# EasyEDA schematic SCH_host-rev-2.0_2025-11-23.json
TITLE: Sheet_1; REV: 2.5; Date: 2025-11-12; Sheet: 1/1; Drawn By: saymonislam924; Company: Your Company
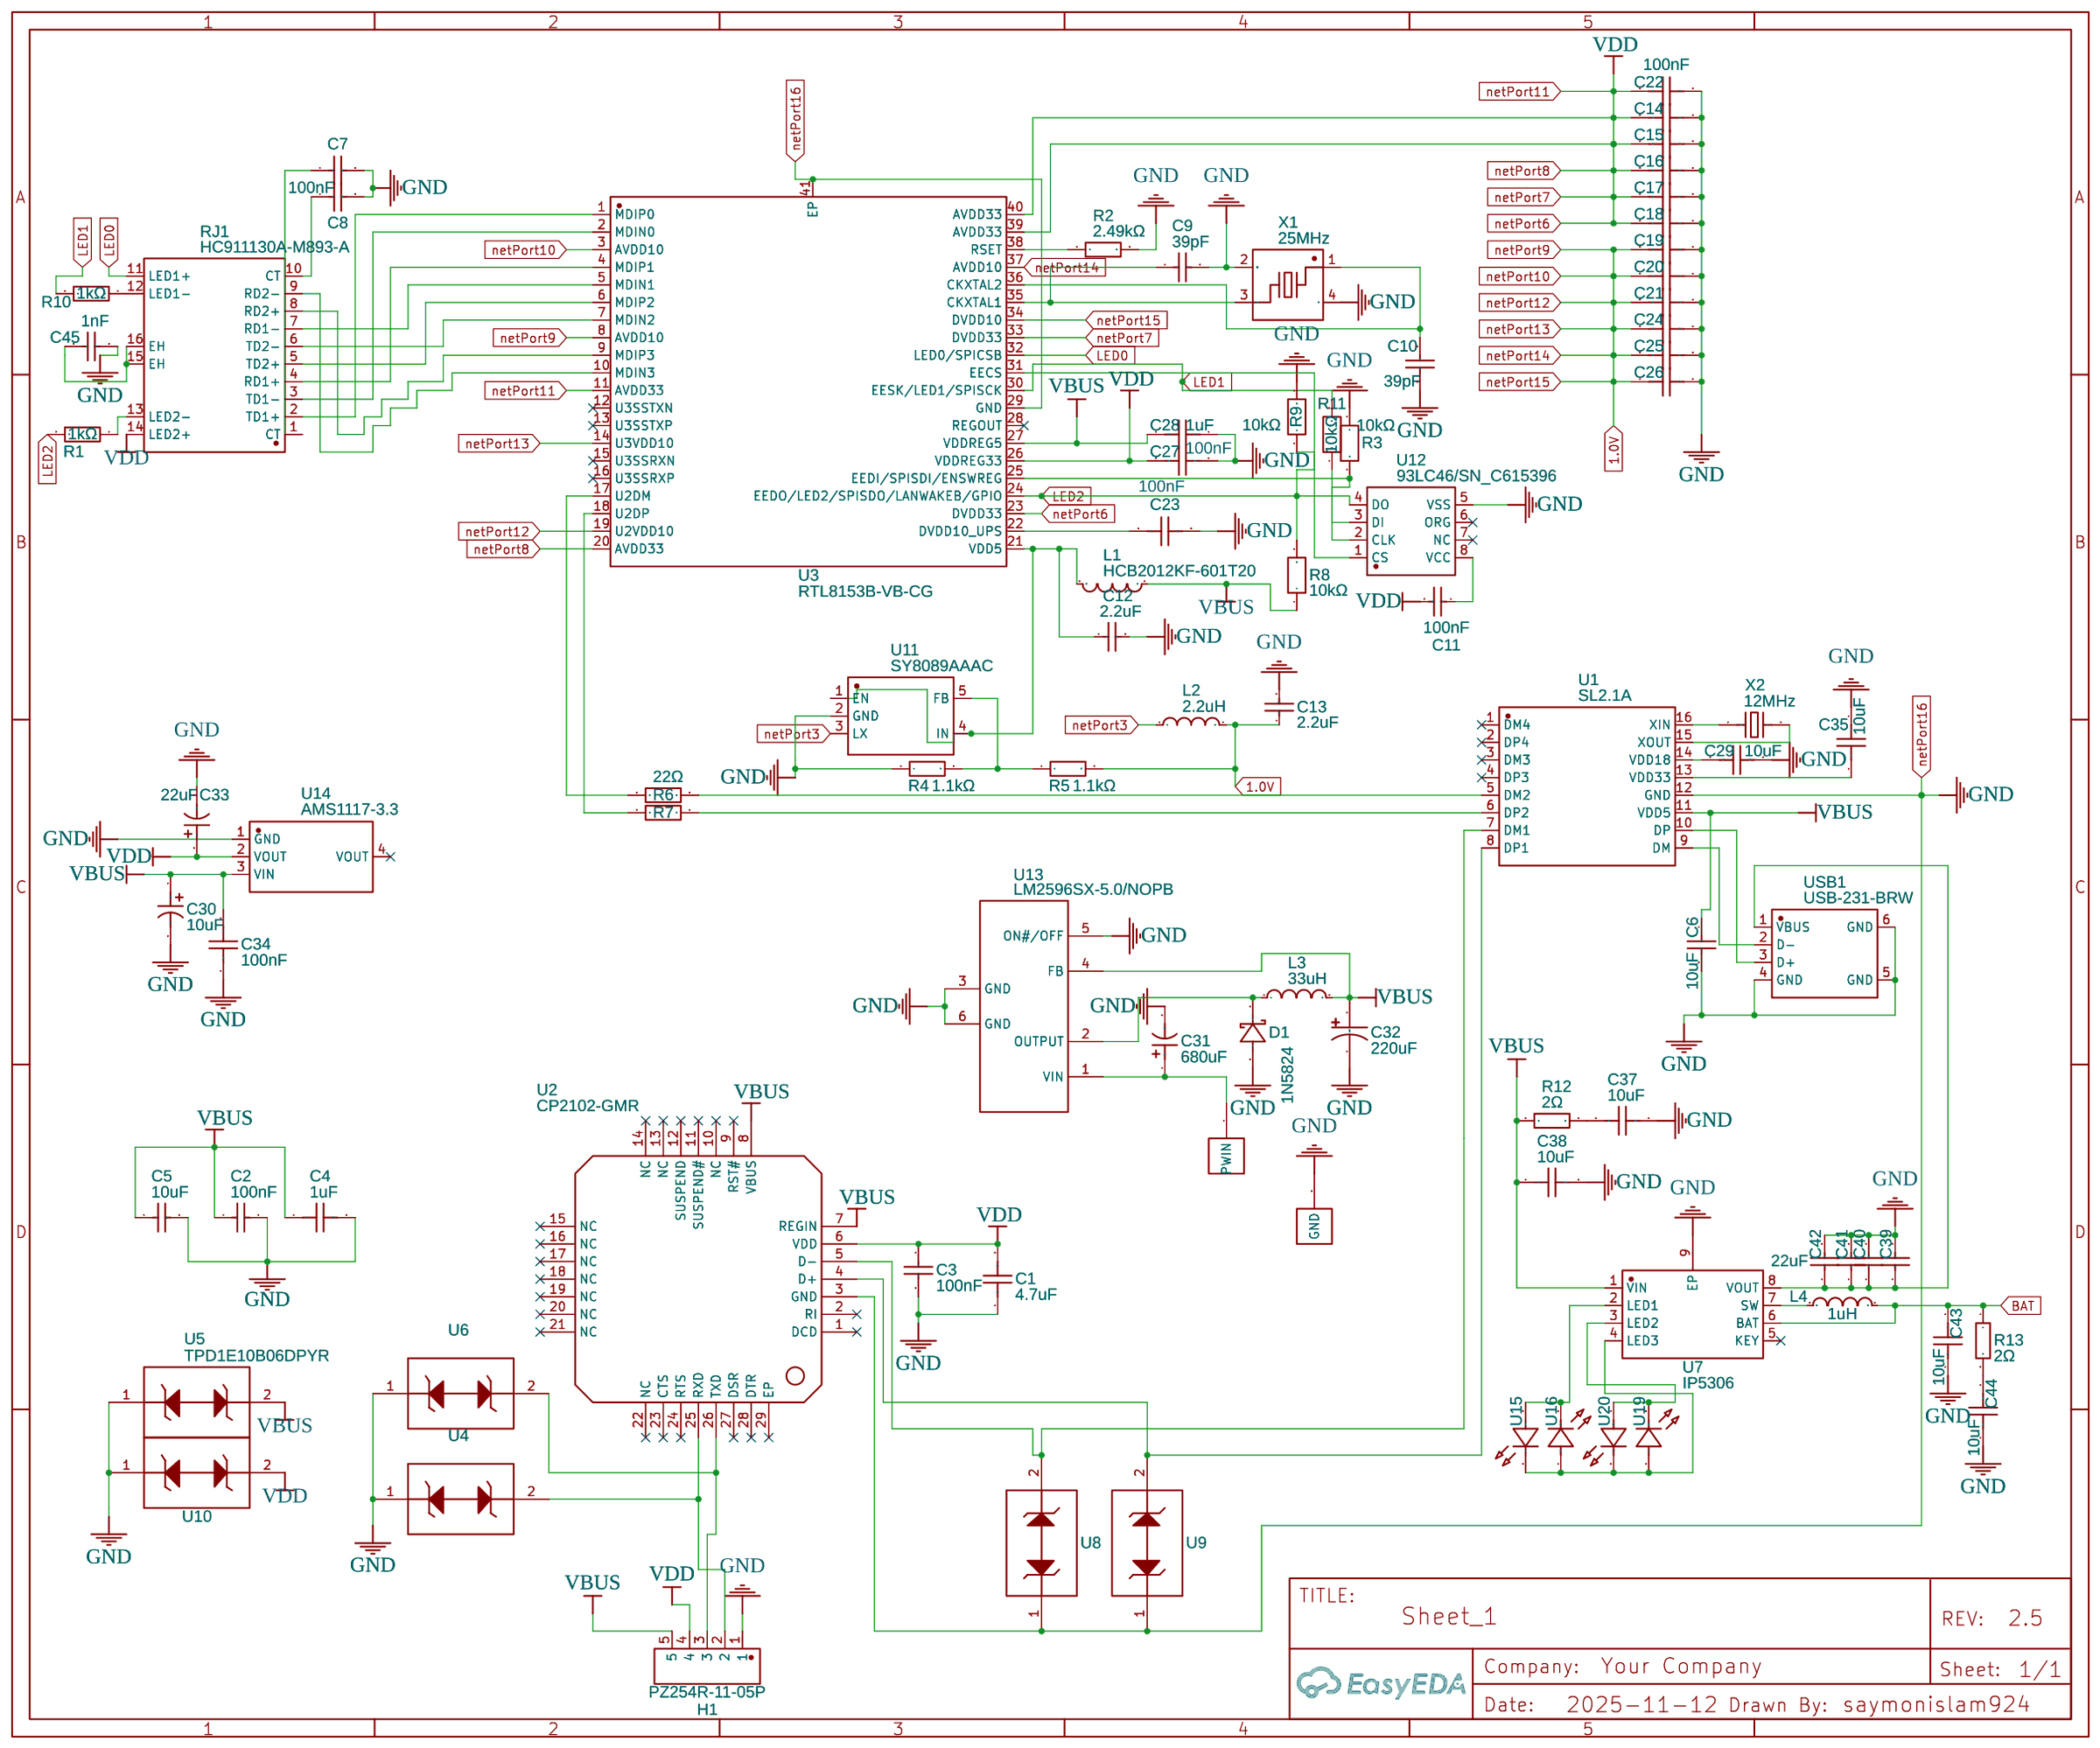
[diagram p0: schematic sheet]

## Parts
C1  4.7uF  [C0402]
C2  100nF  [C0402]
C3  100nF  [C0402]
C4  1uF  [C0402]
C5  10uF  [C0603]
C6  10uF  [C1206]
C7  100nF  [C0402]
C8  100nF  [C0402]
C9  39pF  [C0402]
C10  39pF  [C0402]
C11  100nF  [C0402]
C12  2.2uF  [C0402]
C13  2.2uF  [C0402]
C14  100nF  [C0402]
C15  100nF  [C0402]
C16  100nF  [C0402]
C17  100nF  [C0402]
C18  100nF  [C0402]
C19  100nF  [C0402]
C20  100nF  [C0402]
C21  100nF  [C0402]
C22  100nF  [C0402]
C23  100nF  [C0402]
C24  100nF  [C0402]
C25  100nF  [C0402]
C26  100nF  [C0402]
C27  100nF  [C0402]
C28  1uF  [C0402]
C29  10uF  [C0402]
C30  10uF  [CAP-SMD_BD4.0-L4.3-W4.3-LS5.0-FD]
C31  680uF  [CAP-SMD_BD10.0-L10.3-W10.3-LS11.0-FD]
C32  220uF  [CAP-SMD_BD10.0-L10.3-W10.3-FD]
C33  22uF  [CAP-SMD_L3.2-W1.6]
C34  100nF  [C0805]
C35  10uF  [C0402]
C37  10uF  [C0402]
C38  10uF  [C0402]
C39  22uF  [C1206]
C40  22uF  [C1206]
C41  22uF  [C1206]
C42  22uF  [C1206]
C43  10uF  [C0402]
C44  10uF  [C0402]
C45  1nF  [C1206]
D1  1N5824  [DO-27_BD5.3-L8.4-P12.40-D1.3-RD]
H1  PZ254R-11-05P  [HDR-TH_5P-P2.54-H-M-W10.4]
L1  HCB2012KF-601T20  [L0805]
L2  2.2uH  [IND-SMD_L3.0-W3.0_SMNR3015]
L3  33uH  [IND-SMD_L12.5-W12.5_SMDRS1275]
L4  1uH  [IND-SMD_L3.0-W3.0-1]
R1  1kΩ  [R0402]
R2  2.49kΩ  [R0402]
R3  10kΩ  [R0402]
R4  1.1kΩ  [R0402]
R5  1.1kΩ  [R0402]
R6  22Ω  [R0402]
R7  22Ω  [R0402]
R8  10kΩ  [R0402]
R9  10kΩ  [R0402]
R10  1kΩ  [R0402]
R11  10kΩ  [R0402]
R12  2Ω  [R0603]
R13  2Ω  [R0603]
RJ1  HC911130A-M893-A  [RJ45-TH_HY911130AE]
U1  SL2.1A  [SOP-16_L10.0-W3.9-P1.27-LS6.0-BL]
U2  CP2102-GMR  [WQFN-28_L5.0-W5.0-P0.50-BL-EP3.2]
U3  RTL8153B-VB-CG  [QFN-40_L5.0-W5.0-P0.40-BL-EP3.7]
U4  TPD1E10B06DPYR  [X1SON-2_L1.0-W0.6-P0.65-BI]
U5  TPD1E10B06DPYR  [X1SON-2_L1.0-W0.6-P0.65-BI]
U6  TPD1E10B06DPYR  [X1SON-2_L1.0-W0.6-P0.65-BI]
U7  IP5306  [ESOP-8_L4.9-W3.9-P1.27-LS6.0-BL-EP]
U8  TPD1E10B06DPYR  [X1SON-2_L1.0-W0.6-P0.65-BI]
U9  TPD1E10B06DPYR  [X1SON-2_L1.0-W0.6-P0.65-BI]
U10  TPD1E10B06DPYR  [X1SON-2_L1.0-W0.6-P0.65-BI]
U11  SY8089AAAC  [SOT-23-5_L3.0-W1.7-P0.95-LS2.8-BR]
U12  93LC46/SN_C615396  [SOIC-8_L4.9-W3.9-P1.27-LS6.0-BL]
U13  LM2596SX-5.0/NOPB  [TO-263-5_L10.2-W8.9-P1.70-TL]
U14  AMS1117-3.3  [SOT-223-3_L6.5-W3.4-P2.30-LS7.0-BR]
U15  XL-3216UWC  [LED1206-R-RD_WHITE]
U16  XL-3216UWC  [LED1206-R-RD_WHITE]
U19  XL-3216UWC  [LED1206-R-RD_WHITE]
U20  XL-3216UWC  [LED1206-R-RD_WHITE]
U24  Test-Pad  [PADPAD]
U25  Test-Pad  [PADPAD]
USB1  USB-231-BRW  [USB-A-TH_USB-231-ARY]
X1  25MHz  [CRYSTAL-SMD_4P-L3.2-W2.5-BL]
X2  12MHz  [HC-49S_L7.0-W4.0-LS8.0]

## Library data of the parts
C1 = 0402X475K100NT: Contributor: LCSC; Supplier: LCSC; Supplier Part: C191541; Manufacturer: FH(风华); JLCPCB Part Class: Extended Part
C2 C3 C7 C8 = 0402B104K160NT: Supplier: LCSC; Manufacturer: FH(风华); Supplier Part: C41851; JLCPCB Part Class: Extended Part
C4 = 0402X105M100NT: Supplier: LCSC; Supplier Part: C20616247; Manufacturer: FH(风华); JLCPCB Part Class: Extended Part; Contributor: lcsc
C5 = 0603X106K100NT: Supplier: LCSC; Manufacturer: FH(风华); Supplier Part: C38898; JLCPCB Part Class: Extended Part
C6 = 1206B106K160NT: Supplier: LCSC; Manufacturer: FH(风华); Supplier Part: C39127; JLCPCB Part Class: Extended Part
C9 C10 = 0402CG390J500NT: Supplier: LCSC; Manufacturer: FH(风华); Supplier Part: C1563; JLCPCB Part Class: Extended Part
C11 = 0402B104J160NT: Contributor: LCSC; Supplier: LCSC; Supplier Part: C507422; Manufacturer: FH(风华); JLCPCB Part Class: Extended Part
C12 C13 = 0402X225K6R3NT: Contributor: LCSC; Supplier: LCSC; Supplier Part: C193620; Manufacturer: FH(风华); JLCPCB Part Class: Extended Part
C14-C27 = CC0402KRX5R6BB104: Contributor: LCSC; Supplier: LCSC; Supplier Part: C129131; Manufacturer: YAGEO(国巨); JLCPCB Part Class: Extended Part
C28 = 0402X105K100NT: Contributor: LCSC; Supplier: LCSC; Manufacturer: FH(风华); Supplier Part: C157353; JLCPCB Part Class: Extended Part
C29 C35 C37 C38 C43 C44 = 0402X106M6R3NT: Contributor: LCSC; Supplier: LCSC; Manufacturer: FH(风华); Supplier Part: C163694; JLCPCB Part Class: Extended Part
C30 = RVT1E100M0405 10UF 25V: Supplier: LCSC; Supplier Part: C970655; Manufacturer: DMBJ(振宝佳); JLCPCB Part Class: Extended Part; Contributor: lcsc
C31 = GVE1E687M1010CN: Supplier: LCSC; Supplier Part: C22383566; Manufacturer: ACMECON(鼎容); JLCPCB Part Class: Extended Part; Contributor: lcsc
C32 = EEETC1V221P: Contributor: LCSC; Supplier: LCSC; Supplier Part: C242130; Manufacturer: PANASONIC(松下); JLCPCB Part Class: Extended Part
C33 = CA45-A-10V-22μF-K: Contributor: LCSC; Supplier: LCSC; Supplier Part: C503893; Manufacturer: TORCH(火炬); Manufacturer Part: CA45-A-10V-22uF-K; JLCPCB Part Class: Extended Part
C34 = CT41G-0805-2X1-50V-0.1μF-M(N): Contributor: LCSC; Supplier: LCSC; Supplier Part: C138340; Manufacturer: TORCH(火炬); Manufacturer Part: CT41G-0805-2X1-50V-0.1uF-M(N); JLCPCB Part Class: Extended Part
C39-C42 = 1206X226K100NT: Supplier: LCSC; Manufacturer: FH(风华); Supplier Part: C1859; JLCPCB Part Class: Extended Part
C45 = 1206B102K202NT: Supplier: LCSC; Manufacturer: FH(风华); Supplier Part: C9196; JLCPCB Part Class: Basic Part
D1 = 1N5824_C7503125: Supplier: LCSC; Supplier Part: C7503125; Manufacturer: FUXINSEMI(富芯森美); JLCPCB Part Class: Extended Part; Contributor: lcsc
H1 = PZ254R-11-05P: Contributor: LCSC; Supplier: LCSC; Supplier Part: C492413; Manufacturer: XFCN(兴飞); JLCPCB Part Class: Extended Part
L1 = HCB2012KF-601T20: Contributor: LCSC; Supplier: LCSC; Supplier Part: C304329; Manufacturer: TAI-TECH(台庆); JLCPCB Part Class: Extended Part
L2 = ANR3015T2R2M: Supplier: LCSC; Supplier Part: C6364793; Manufacturer: APV(爱普微); JLCPCB Part Class: Extended Part; Contributor: lcsc
L3 = SMDRS1275-330N: Contributor: LCSC; Supplier: LCSC; Manufacturer: SXN(顺翔诺); Supplier Part: C163685; JLCPCB Part Class: Extended Part
L4 = PRS3015-1R0NT: Supplier: LCSC; Manufacturer: FH(风华); Supplier Part: C96144; JLCPCB Part Class: Extended Part
R1 R10 = RC-02K1001FT: Contributor: LCSC; Supplier: LCSC; Supplier Part: C140197; Manufacturer: FH(风华); JLCPCB Part Class: Extended Part
R2 = RC-02K2491FT: Contributor: LCSC; Supplier: LCSC; Supplier Part: C140190; Manufacturer: FH(风华); JLCPCB Part Class: Extended Part
R3 R8 R9 R11 = RC-02K103JT: Supplier: LCSC; Supplier Part: C453512; Manufacturer: FH(风华); JLCPCB Part Class: Extended Part; Contributor: lcsc
R4 R5 = RC-02K1101FT: Contributor: LCSC; Supplier: LCSC; Supplier Part: C140223; Manufacturer: FH(风华); JLCPCB Part Class: Extended Part
R6 R7 = RC-02K22R0FT: Contributor: LCSC; Supplier: LCSC; Supplier Part: C324769; Manufacturer: FH(风华); JLCPCB Part Class: Extended Part
R12 R13 = RS-03L2R00FT: Contributor: LCSC; Supplier: LCSC; Supplier Part: C322115; Manufacturer: FH(风华); JLCPCB Part Class: Extended Part
RJ1 = HC911130A-M893-A: Contributor: lcsc; Supplier: LCSC; Supplier Part: C3021368; Manufacturer: HCTL(华灿天禄); Manufacturer Part: HC612601A-M893-A; JLCPCB Part Class: Extended Part
U1 = SL2.1A: Contributor: LCSC; Supplier: LCSC; Supplier Part: C192893; Manufacturer: CoreChips(和芯润德); JLCPCB Part Class: Extended Part
U2 = CP2102-GMR: Supplier: LCSC; Manufacturer: SKYWORKS/SILICON LABS(芯科); Supplier Part: C6568; JLCPCB Part Class: Extended Part
U3 = RTL8153B-VB-CG: Contributor: LCSC; Supplier: LCSC; Supplier Part: C2802072; Manufacturer: REALTEK(瑞昱); JLCPCB Part Class: Extended Part
U4-U6 U8-U10 = TPD1E10B06DPYR: Contributor: LCSC; Supplier: LCSC; Manufacturer: TI(德州仪器); Supplier Part: C48260; JLCPCB Part Class: Extended Part
U7 = IP5306: Contributor: LCSC; Supplier: LCSC; Supplier Part: C181692; Manufacturer: INJOINIC(英集芯); JLCPCB Part Class: Extended Part
U11 = SY8089AAAC: Supplier: LCSC; Manufacturer: Silergy(矽力杰); Supplier Part: C78988; JLCPCB Part Class: Extended Part
U12 = 93LC46/SN_C615396: Contributor: LCSC; Supplier: LCSC; Supplier Part: C615396; Manufacturer: MICROCHIP(美国微芯); Manufacturer Part: 93LC46/SN; JLCPCB Part Class: Extended Part
U13 = LM2596SX-5.0/NOPB: Supplier: LCSC; Manufacturer: TI(德州仪器); Supplier Part: C10002; JLCPCB Part Class: Extended Part
U14 = AMS1117-3.3: sourceId: dwIGgezVh; Supplier: LCSC; Manufacturer: AMS; Supplier Part: C6186; JLCPCB Part Class: Basic Part
U15 U16 U19 U20 = XL-3216UWC: Supplier: LCSC; Supplier Part: C965828; Manufacturer: XINGLIGHT(成兴光); JLCPCB Part Class: Extended Part; Contributor: lcsc
U24 U25 = Test-Pad: Contributor: Kamenchuk
USB1 = USB-231-BRW: Contributor: LCSC; Supplier: LCSC; Supplier Part: C720526; Manufacturer: XUNPU(讯普); JLCPCB Part Class: Extended Part
X1 = XXHCCLNANF-25.000000: Contributor: LCSC; Supplier: LCSC; Supplier Part: C603160; Manufacturer: TAITIEN(泰艺电子); JLCPCB Part Class: Extended Part
X2 = S47SMD12.000M20PF20R30B3: Supplier: LCSC; Supplier Part: C5346045; Manufacturer: SOSET(索斯特); JLCPCB Part Class: Extended Part; Contributor: lcsc

## Nets
1.0V: C13.1 C19.1 C20.1 C21.1 C24.1 C25.1 C26.1 L2.2 R5.2 U3.3(AVDD10) U3.8(AVDD10) U3.14(U3VDD10) U3.19(U2VDD10) U3.34(DVDD10) U3.37(AVDD10)
GND: C1.1 C2.2 C3.2 C4.2 C5.2 C6.2 C7.2 C8.2 C9.2 C10.2 C12.2 C13.2 C14.2 C15.2 C16.2 C17.2 C18.2 C19.2 C20.2 C21.2 C22.2 C23.2 C24.2 C25.2 C26.2 C27.2 C28.1 C29.1 C30.2 C31.2 C32.2 C33.2 C34.2 C35.1 C37.1 C38.1 C39.2 C40.2 C41.2 C42.2 C43.1 C44.1 C45.2 D1.2(A) H1.1 R2.2 R3.2 R4.1 R9.2 U1.12(GND) U2.3(GND) U3.29(GND) U3.41(EP) U4.1 U5.1 U6.1 U7.9(EP) U8.1 U9.1 U10.1 U11.2(GND) U12.5(VSS) U13.3(GND) U13.5(ON#/OFF) U13.6(GND) U14.1(GND) U25.1(GND) USB1.4(GND) USB1.5(GND) USB1.6(GND) X1.2(GND) X1.4(GND)
VBUS: C2.1 C4.1 C5.1 C6.1 C28.2 C30.1 C32.1 C34.1 C38.2 H1.5 L1.1 L3.2 R8.1 R12.1 U1.11(VDD5) U2.7(REGIN) U2.8(VBUS) U3.27(VDDREG5) U5.2 U7.1(VIN) U13.4(FB) U14.3(VIN)
VDD: C1.2 C3.1 C11.2 C14.1 C15.1 C16.1 C17.1 C18.1 C22.1 C27.1 C33.1 H1.4 RJ1.14(LED2+) U2.6(VDD) U3.11(AVDD33) U3.20(AVDD33) U3.23(DVDD33) U3.26(VDDREG33) U3.33(DVDD33) U3.39(AVDD33) U3.40(AVDD33) U10.2 U14.2(VOUT)
BAT: C43.2 L4.1 R13.1 U7.6(BAT)
LED0: RJ1.11(LED1+) U3.32(LED0/SPICSB)
LED1: R10.2 R11.2 U3.30(EESK/LED1/SPISCK)
LED2: R1.2 R8.2 R9.1 U3.24(EEDO/LED2/SPISDO/LANWAKEB/GPIO) U12.4(DO)
netPort3: L2.1 U11.3(LX)
Net-(C7-1): C7.1 RJ1.1(CT)
Net-(C8-1): C8.1 RJ1.10(CT)
Net-(C9-1): C9.1 U3.35(CKXTAL1) X1.3
Net-(C10-1): C10.1 U3.36(CKXTAL2) X1.1
Net-(C11-1): C11.1 U12.8(VCC)
Net-(C12-1): C12.1 L1.2 U3.21(VDD5) U11.1(EN) U11.4(IN)
Net-(C23-1): C23.1 U3.22(DVDD10_UPS)
Net-(C29-2): C29.2 U1.14(VDD18)
Net-(C31-1): C31.1 U13.1(VIN) U24.1(PWIN)
Net-(C35-2): C35.2 U1.13(VDD33)
Net-(C37-2): C37.2 R12.2
Net-(C39-1): C39.1 C40.1 C41.1 C42.1 U7.8(VOUT) USB1.1(VBUS)
Net-(C44-2): C44.2 R13.2
Net-(C45-1): C45.1 RJ1.15(EH) RJ1.16(EH)
Net-(D1-1): D1.1(K) L3.1 U13.2(OUTPUT)
Net-(H1-2): H1.2 U2.25(RXD) U4.2
Net-(H1-3): H1.3 U2.26(TXD) U6.2
Net-(L4-2): L4.2 U7.7(SW)
Net-(R1-1): R1.1 RJ1.13(LED2-)
Net-(R2-1): R2.1 U3.38(RSET)
Net-(R3-1): R3.1 U3.25(EEDI/SPISDI/ENSWREG) U12.3(DI)
Net-(R4-2): R4.2 R5.1 U11.5(FB)
Net-(R6-1): R6.1 U1.5(DM2)
Net-(R6-2): R6.2 U3.17(U2DM)
Net-(R7-1): R7.1 U1.6(DP2)
Net-(R7-2): R7.2 U3.18(U2DP)
Net-(R10-1): R10.1 RJ1.12(LED1-)
Net-(R11-1): R11.1 U12.2(CLK)
Net-(RJ1-2): RJ1.2(TD1+) U3.1(MDIP0)
Net-(RJ1-3): RJ1.3(TD1-) U3.2(MDIN0)
Net-(RJ1-4): RJ1.4(RD1+) U3.4(MDIP1)
Net-(RJ1-5): RJ1.5(TD2+) U3.6(MDIP2)
Net-(RJ1-6): RJ1.6(TD2-) U3.7(MDIN2)
Net-(RJ1-7): RJ1.7(RD1-) U3.5(MDIN1)
Net-(RJ1-8): RJ1.8(RD2+) U3.9(MDIP3)
Net-(RJ1-9): RJ1.9(RD2-) U3.10(MDIN3)
Net-(U1-7): U1.7(DM1) U2.5(D-) U8.2
Net-(U1-8): U1.8(DP1) U2.4(D+) U9.2
Net-(U1-9): U1.9(DM) USB1.2(D-)
Net-(U1-10): U1.10(DP) USB1.3(D+)
Net-(U1-15): U1.15(XOUT) X2.2
Net-(U1-16): U1.16(XIN) X2.1
Net-(U3-31): U3.31(EECS) U12.1(CS)
Net-(U7-2): U7.2(LED1) U15.1(A) U16.2(K)
Net-(U7-3): U7.3(LED2) U19.2(K) U20.1(A)
Net-(U7-4): U7.4(LED3) U15.2(K) U16.1(A) U19.1(A) U20.2(K)

Not connected (* = marked no-connect by the designer): U1 1(DM4)* 2(DP4)* 3(DM3)* 4(DP3)*; U2 1(DCD)* 2(RI)* 9(RST#)* 10(NC)* 11(SUSPEND#)* 12(SUSPEND)* 13(NC)* 14(NC)* 15(NC)* 16(NC)* 17(NC)* 18(NC)* 19(NC)* 20(NC)* 21(NC)* 22(NC)* 23(CTS)* 24(RTS)* 27(DSR)* 28(DTR)* 29(EP)*; U3 12(U3SSTXN)* 13(U3SSTXP)* 15(U3SSRXN)* 16(U3SSRXP)* 28(REGOUT)*; U7 5(KEY)*; U12 6(ORG)* 7(NC)*; U14 4(VOUT)*

## Notes on the sheet
- 100nF
- 100nF
